# EAGLE schematic PlayerTop (EAGLE 9.6.1)
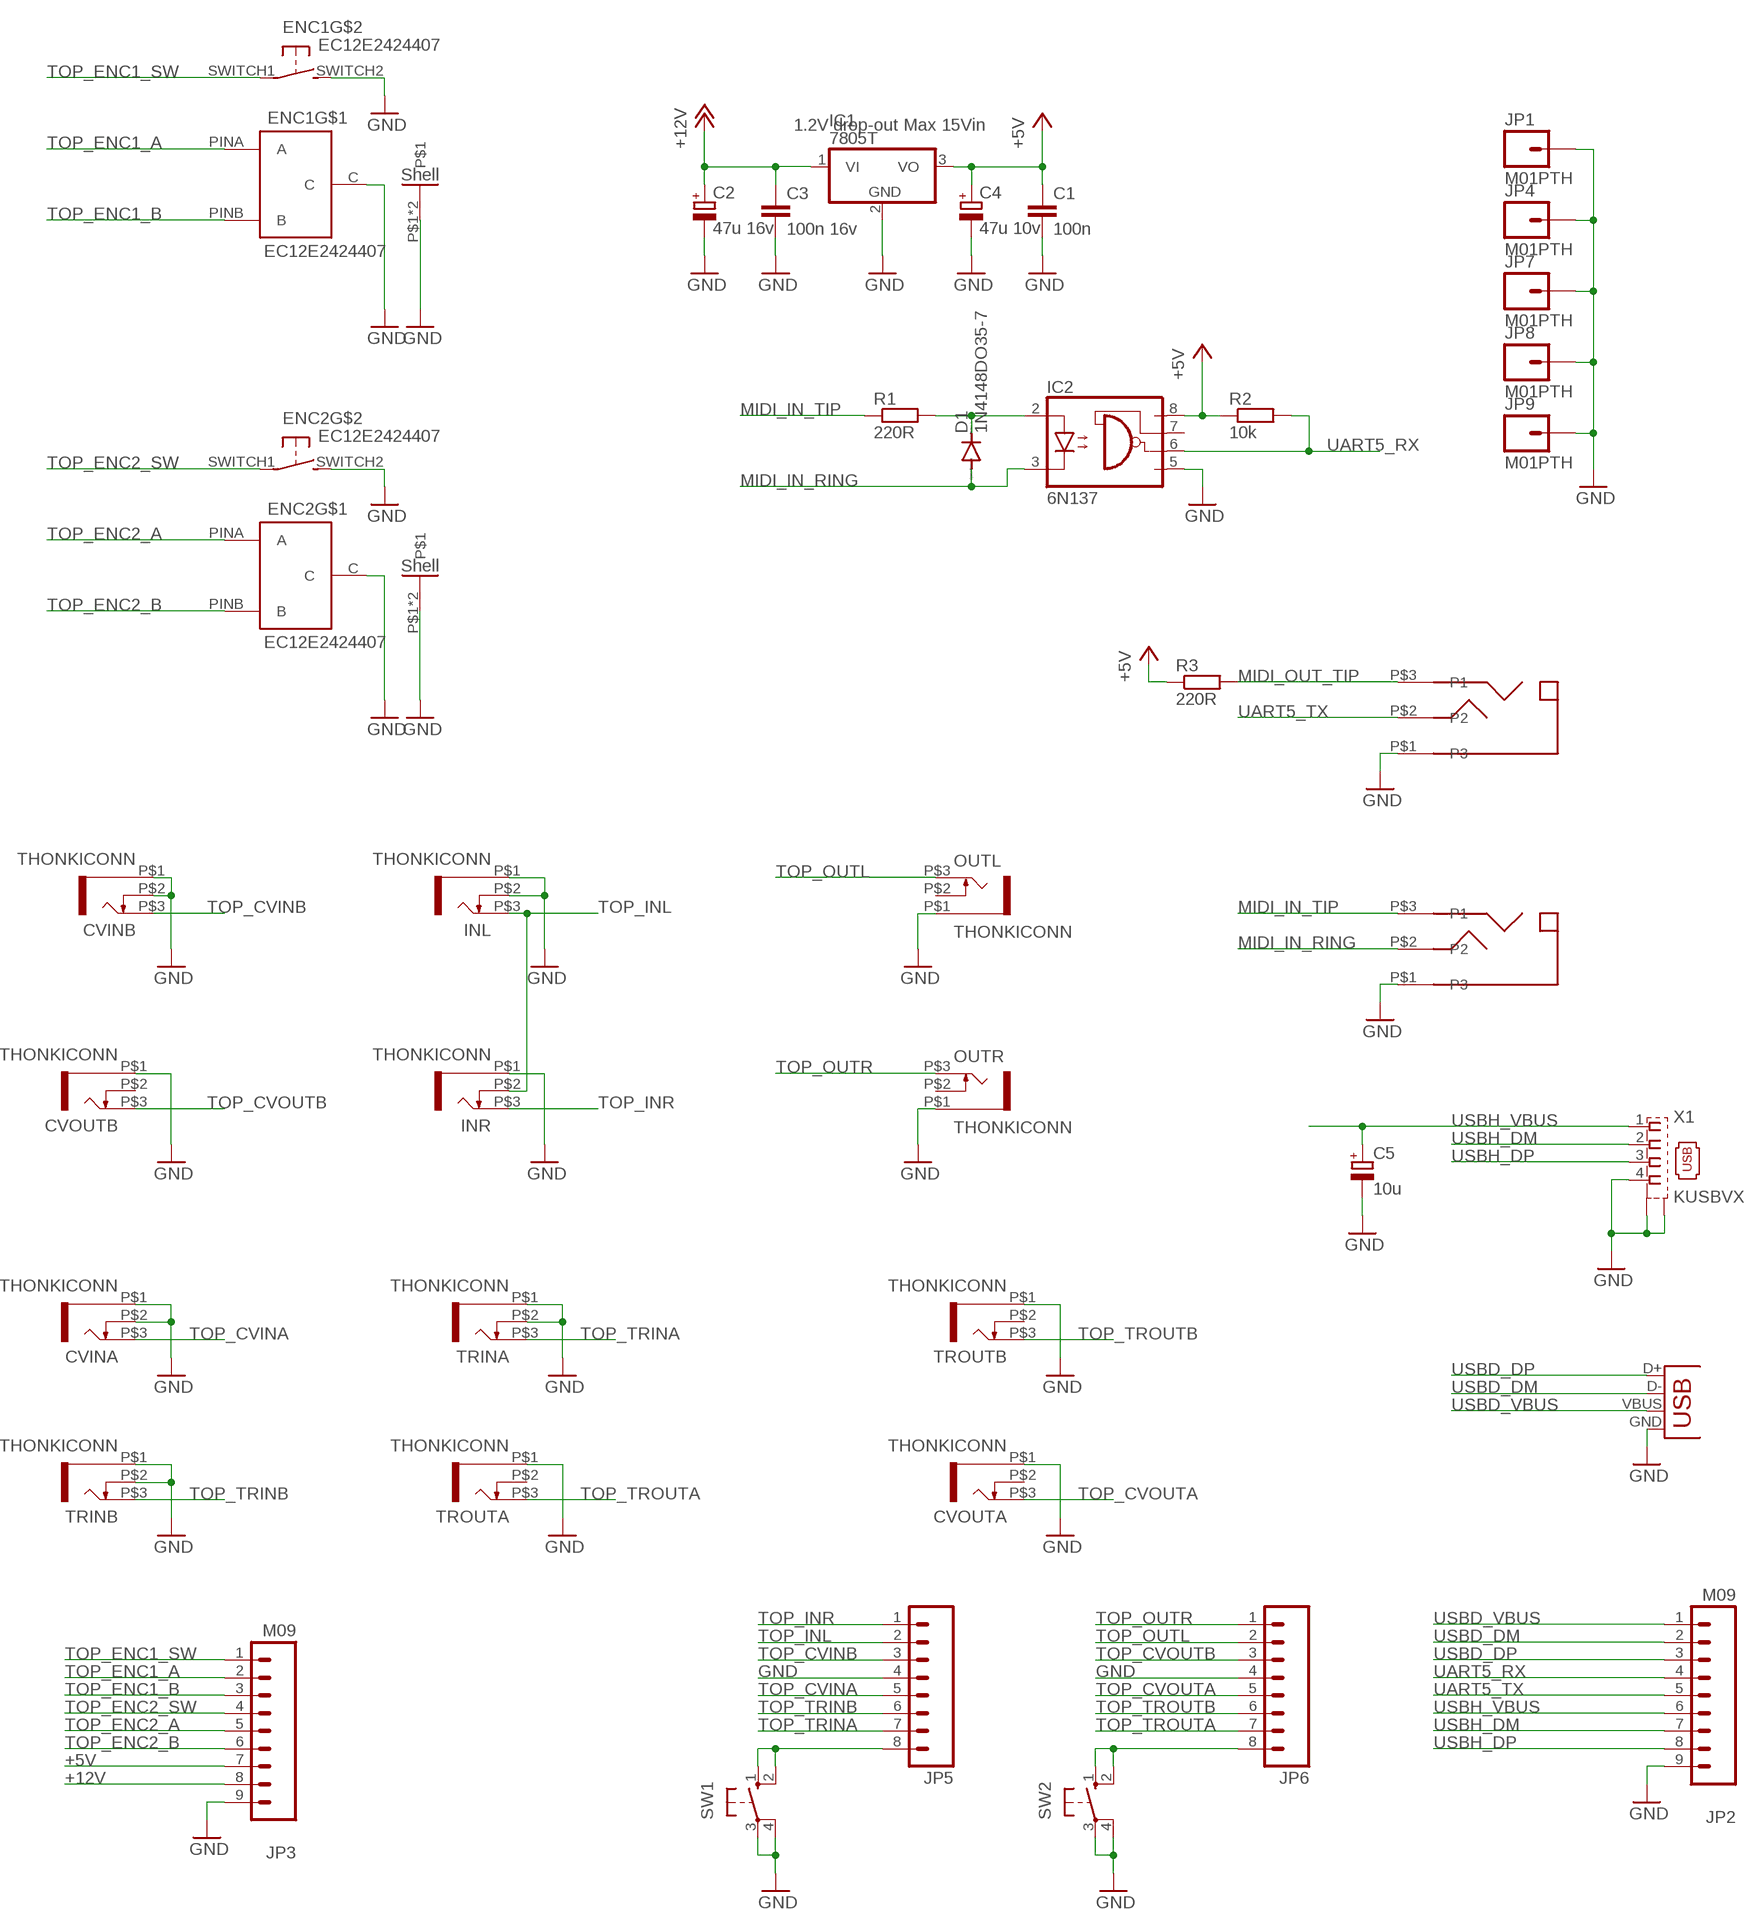
[diagram p0: schematic, sheet 1]

## Parts
C1  100n  C-EU050-024X044  [C050-024X044]
C2  47u 16v  CPOL-EUE5-6  [E5-6]
C3  100n 16v  C-EU050-024X044  [C050-024X044]
C4  47u 10v  CPOL-EUE5-6  [E5-6]
C5  10u  CPOL-EUE2.5-6  [E2,5-6]
CVINA  THONKICONN  [THONKICONN]
CVINB  THONKICONN  [THONKICONN]
CVOUTA  THONKICONN  [THONKICONN]
CVOUTB  THONKICONN  [THONKICONN]
D1  1N4148DO35-7  [DO35-7]
ENC1  EC12E2424407  [EC12E2424407]
ENC2  EC12E2424407  [EC12E2424407]
IC1  7805T  [TO220H]
IC2  6N137  [DIL08]
INL  THONKICONN  [THONKICONN]
INR  THONKICONN  [THONKICONN]
JP1  M01PTH  [1X01]
JP2  M09  [1X09]
JP3  M09  [1X09]
JP4  M01PTH  [1X01]
JP5  M081X08  [1X08]
JP6  M081X08  [1X08]
JP7  M01PTH  [1X01]
JP8  M01PTH  [1X01]
JP9  M01PTH  [1X01]
MIDI_IN  THONKICONN_STEREO  [THONKICONN_STEREO]
MIDI_OUT  THONKICONN_STEREO  [THONKICONN_STEREO]
OUTL  THONKICONN  [THONKICONN]
OUTR  THONKICONN  [THONKICONN]
R1  220R  R-EU_0204/7  [0204/7]
R2  10k  R-EU_0204/7  [0204/7]
R3  220R  R-EU_0204/7  [0204/7]
SW1  10-XX  [B3F-10XX]
SW2  10-XX  [B3F-10XX]
TRINA  THONKICONN  [THONKICONN]
TRINB  THONKICONN  [THONKICONN]
TROUTA  THONKICONN  [THONKICONN]
TROUTB  THONKICONN  [THONKICONN]
X1  KUSBVX  [KUSBVX]
X2  USBPTH-VERTICAL  [USB-B-PTH-VERTICAL]

## Nets
+5V: C1.1 C4.+ IC1.3(VO) IC2.8(VCC) JP3.7 R2.1 R3.1
+12V: C2.+ C3.1 IC1.1(VI) JP3.8
GND: C1.2 C2.- C3.2 C4.- C5.- CVINA.P$1 CVINA.P$2 CVINB.P$1 CVINB.P$2 CVOUTA.P$1 CVOUTB.P$1 ENC1.C ENC1.P$1 ENC1.P$2 ENC1.SWITCH2(S) ENC2.C ENC2.P$1 ENC2.P$2 ENC2.SWITCH2(S) IC1.2(GND) IC2.5(GND) INL.P$1 INL.P$2 INR.P$1 JP1.1 JP2.9 JP3.9 JP4.1 JP5.4 JP6.4 JP7.1 JP8.1 JP9.1 MIDI_IN.P$1(P3) MIDI_OUT.P$1(P3) OUTL.P$1 OUTR.P$1 SW1.3(P) SW1.4(P1) SW2.3(P) SW2.4(P1) TRINA.P$1 TRINA.P$2 TRINB.P$1 TRINB.P$2 TROUTA.P$1 TROUTB.P$1 X1.4 X1.M1(S1) X1.M2(S2) X2.GND
MIDI_IN_RING: D1.A IC2.3(C) MIDI_IN.P$2(P2)
MIDI_IN_TIP: MIDI_IN.P$3(P1) R1.1
MIDI_OUT_TIP: MIDI_OUT.P$3(P1) R3.2
N$1: D1.C IC2.2(A) R1.2
N$3: JP5.8 SW1.1(S) SW1.2(S1)
N$4: JP6.8 SW2.1(S) SW2.2(S1)
TOP_CVINA: CVINA.P$3 JP5.5
TOP_CVINB: CVINB.P$3 JP5.3
TOP_CVOUTA: CVOUTA.P$3 JP6.5
TOP_CVOUTB: CVOUTB.P$3 JP6.3
TOP_ENC1_A: ENC1.PINA(A) JP3.2
TOP_ENC1_B: ENC1.PINB(B) JP3.3
TOP_ENC1_SW: ENC1.SWITCH1(P) JP3.1
TOP_ENC2_A: ENC2.PINA(A) JP3.5
TOP_ENC2_B: ENC2.PINB(B) JP3.6
TOP_ENC2_SW: ENC2.SWITCH1(P) JP3.4
TOP_INL: INL.P$3 INR.P$2 JP5.2
TOP_INR: INR.P$3 JP5.1
TOP_OUTL: JP6.2 OUTL.P$3
TOP_OUTR: JP6.1 OUTR.P$3
TOP_TRINA: JP5.7 TRINA.P$3
TOP_TRINB: JP5.6 TRINB.P$3
TOP_TROUTA: JP6.7 TROUTA.P$3
TOP_TROUTB: JP6.6 TROUTB.P$3
UART5_RX: IC2.6(VO) JP2.4 R2.2
UART5_TX: JP2.5 MIDI_OUT.P$2(P2)
USBD_DM: JP2.2 X2.D-
USBD_DP: JP2.3 X2.D+
USBD_VBUS: JP2.1 X2.VBUS
USBH_DM: JP2.7 X1.2
USBH_DP: JP2.8 X1.3
USBH_VBUS: C5.+ JP2.6 X1.1
Unconnected: CVOUTA.P$2 CVOUTB.P$2 IC2.7(VE) OUTL.P$2 OUTR.P$2 TROUTA.P$2 TROUTB.P$2

## Notes on the sheet
- 1.2V drop-out Max 15Vin

## Library data of the parts
C1 C3 = Rebel:C-EU: CAPACITOR, European symbol
C2 C4 C5 = Rebel:CPOL-EU: POLARIZED CAPACITOR, European symbol
CVINA CVINB CVOUTA CVOUTB INL INR OUTL OUTR TRINA TRINB TROUTA TROUTB = Rebel:THONKICONN
D1 = diode:1N4148: DIODE high speed (Philips)
ENC1 ENC2 = Rebel:EC12E2424407: rotary encoder with switch EC12E2424407
IC1 = adafruit:78*: Positive VOLTAGE REGULATOR Added bigger pads to the TO-92 package
IC2 = optocoupler:6N137: MOTOROLA OPTO COUPLER; MPN: 6N137; OC_FARNELL: 1328376; OC_NEWARK: 52M1895
JP1 JP4 JP7-JP9 = SparkFun:M01: Header 1 Standard 1-pin 0.1" header. Use with straight break away headers (SKU : PRT-00116), right angle break away headers (PRT-00553), swiss pins (PRT-00743), machine pins (PRT-00117), and female headers (PRT-00115).
JP2 JP3 = SparkFun:M09: Header 9 Standard 9-pin 0.1" header. Use with straight break away headers (SKU : PRT-00116), right angle break away headers (PRT-00553), swiss pins (PRT-00743), machine pins (PRT-00117), and female headers (PRT-00115).
JP5 JP6 = SparkFun:M08: Header 8 Standard 8-pin 0.1" header. Use with straight break away headers (SKU : PRT-00116), right angle break away headers (PRT-00553), swiss pins (PRT-00743), machine pins (PRT-00117), and female headers (PRT-00115).
MIDI_IN MIDI_OUT = Rebel:THONKICONN_STEREO
R1-R3 = Rebel:R-EU_: RESISTOR, European symbol
SW1 SW2 = switch-omron:10-XX: OMRON SWITCH; MPN: B3F-1000; OC_FARNELL: 176432; OC_NEWARK: 36M3542
X1 = con-kycon:KUSBVX: Vertical,Top Entry Universal Serial Bus Connector KUSBVX Series Source: KYCON Sibalco USB vertical socket KUSBV.pdf
X2 = SparkFun:USB: USB Connectors USB-B-PTH is fully proven SKU : PRT-00139 USB-miniB is fully proven SKU : PRT-00587 USB-A-PCB is untested. USB-A-H is throughly reviewed, but untested. Spark Fun Electronics SKU : PRT-00437 USB-B-SMT is throughly reviewed, but untested. Needs silkscreen touching up. USB-A-S has not been used/tested USB-MB-H has not been used/tested

## Net classes
1 power: width 0.178 mm, drill 0.305 mm, clearance 0.178 mm to class 0, clearance 0.178 mm